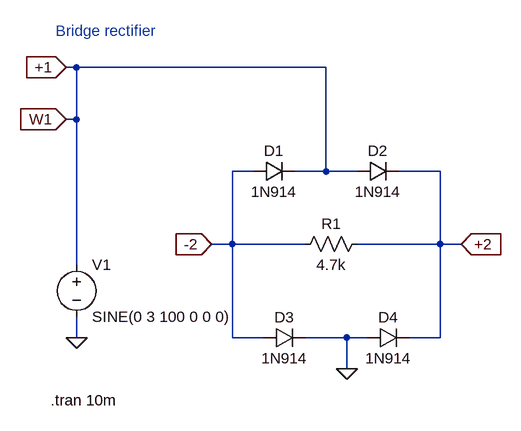
[diagram p0: schematic bridge_rect.asc]
bridge_rect.asc, the LTspice schematic file:
Version 4
SHEET 1 880 680
WIRE -176 0 -192 0
WIRE 208 0 -176 0
WIRE -176 80 -176 0
WIRE -176 80 -192 80
WIRE 96 160 64 160
WIRE 208 160 208 0
WIRE 208 160 160 160
WIRE 256 160 208 160
WIRE 384 160 320 160
WIRE 64 272 64 160
WIRE 64 272 32 272
WIRE 176 272 64 272
WIRE 384 272 384 160
WIRE 384 272 256 272
WIRE 416 272 384 272
WIRE -176 304 -176 80
WIRE -176 416 -176 384
WIRE 64 416 64 272
WIRE 112 416 64 416
WIRE 240 416 176 416
WIRE 272 416 240 416
WIRE 384 416 384 272
WIRE 384 416 336 416
WIRE 240 464 240 416
FLAG 240 464 0
FLAG -176 416 0
FLAG -192 0 +1
IOPIN -192 0 In
FLAG 32 272 -2
IOPIN 32 272 In
FLAG 416 272 +2
IOPIN 416 272 In
FLAG -192 80 W1
IOPIN -192 80 In
SYMBOL diode 96 176 R270
WINDOW 0 32 32 VTop 2
WINDOW 3 0 32 VBottom 2
SYMATTR InstName D1
SYMATTR Value 1N914
SYMBOL res 160 288 R270
WINDOW 0 32 56 VTop 2
WINDOW 3 0 56 VBottom 2
SYMATTR InstName R1
SYMATTR Value 4.7k
SYMBOL voltage -176 288 R0
WINDOW 123 0 0 Left 0
WINDOW 39 0 0 Left 0
SYMATTR InstName V1
SYMATTR Value SINE(0 3 100 0 0 0)
SYMBOL diode 256 176 R270
WINDOW 0 32 32 VTop 2
WINDOW 3 0 32 VBottom 2
SYMATTR InstName D2
SYMATTR Value 1N914
SYMBOL diode 112 432 R270
WINDOW 0 32 32 VTop 2
WINDOW 3 0 32 VBottom 2
SYMATTR InstName D3
SYMATTR Value 1N914
SYMBOL diode 272 432 R270
WINDOW 0 32 32 VTop 2
WINDOW 3 0 32 VBottom 2
SYMATTR InstName D4
SYMATTR Value 1N914
TEXT -208 -56 Left 2 ;Bridge rectifier
TEXT -216 512 Left 2 !.tran 10m

The netlist it stands for:
* bridge_rect.asc
D1 -2 W1 1N914
R1 -2 +2 4.7k
V1 W1 0 SINE(0 3 100 0 0 0)
D2 W1 +2 1N914
D3 -2 0 1N914
D4 0 +2 1N914
.model D D
.lib standard.dio
* Bridge rectifier
.tran 10m
.backanno
.end